# Altium project PCB_Project4.PrjPCB
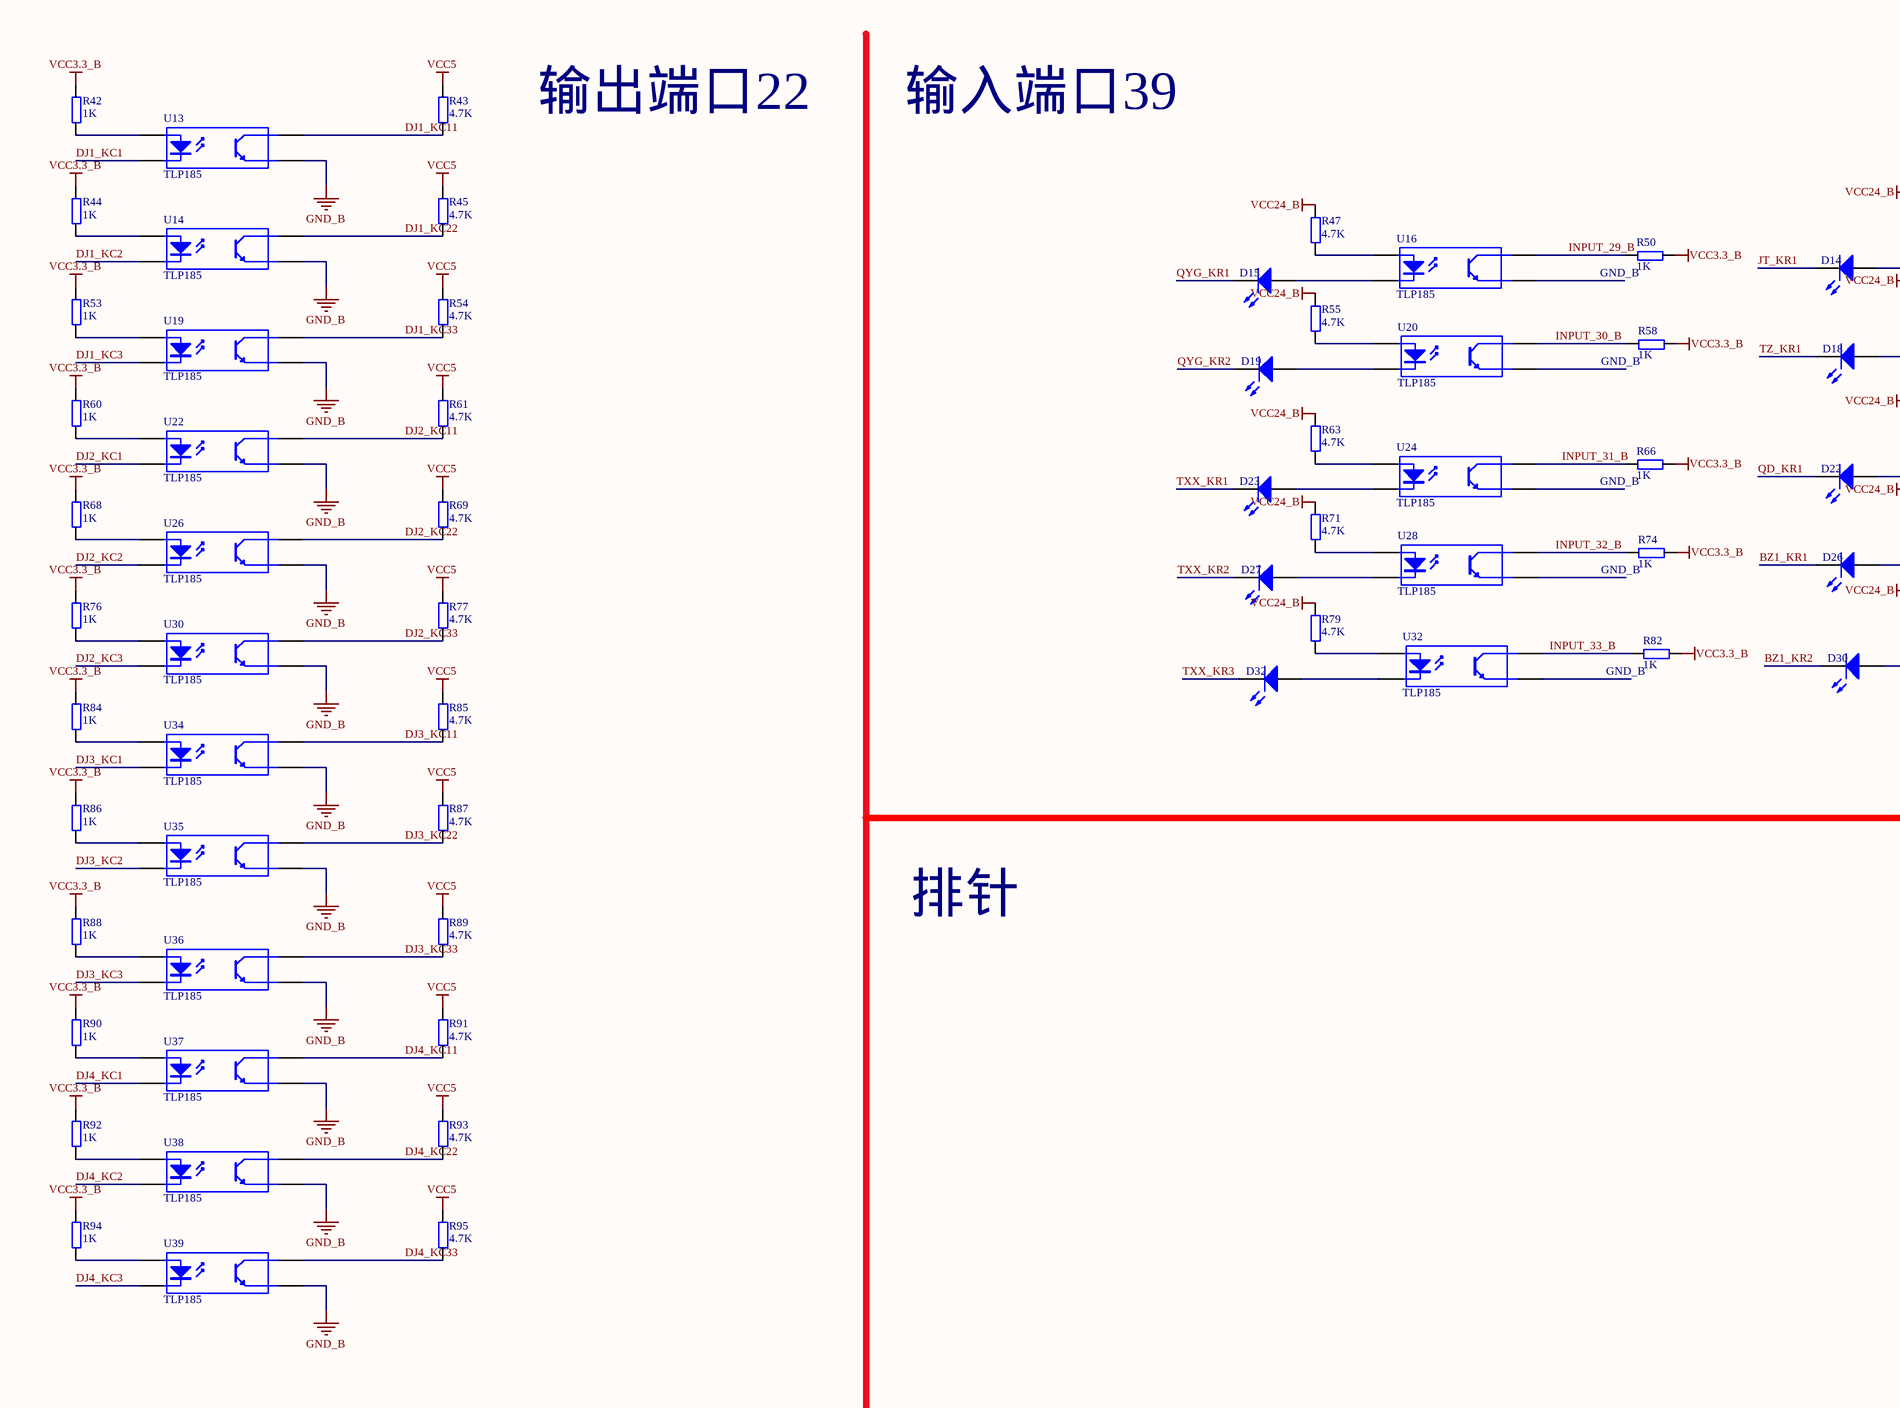
[diagram p0: 底板20160428.SchDoc, top left]
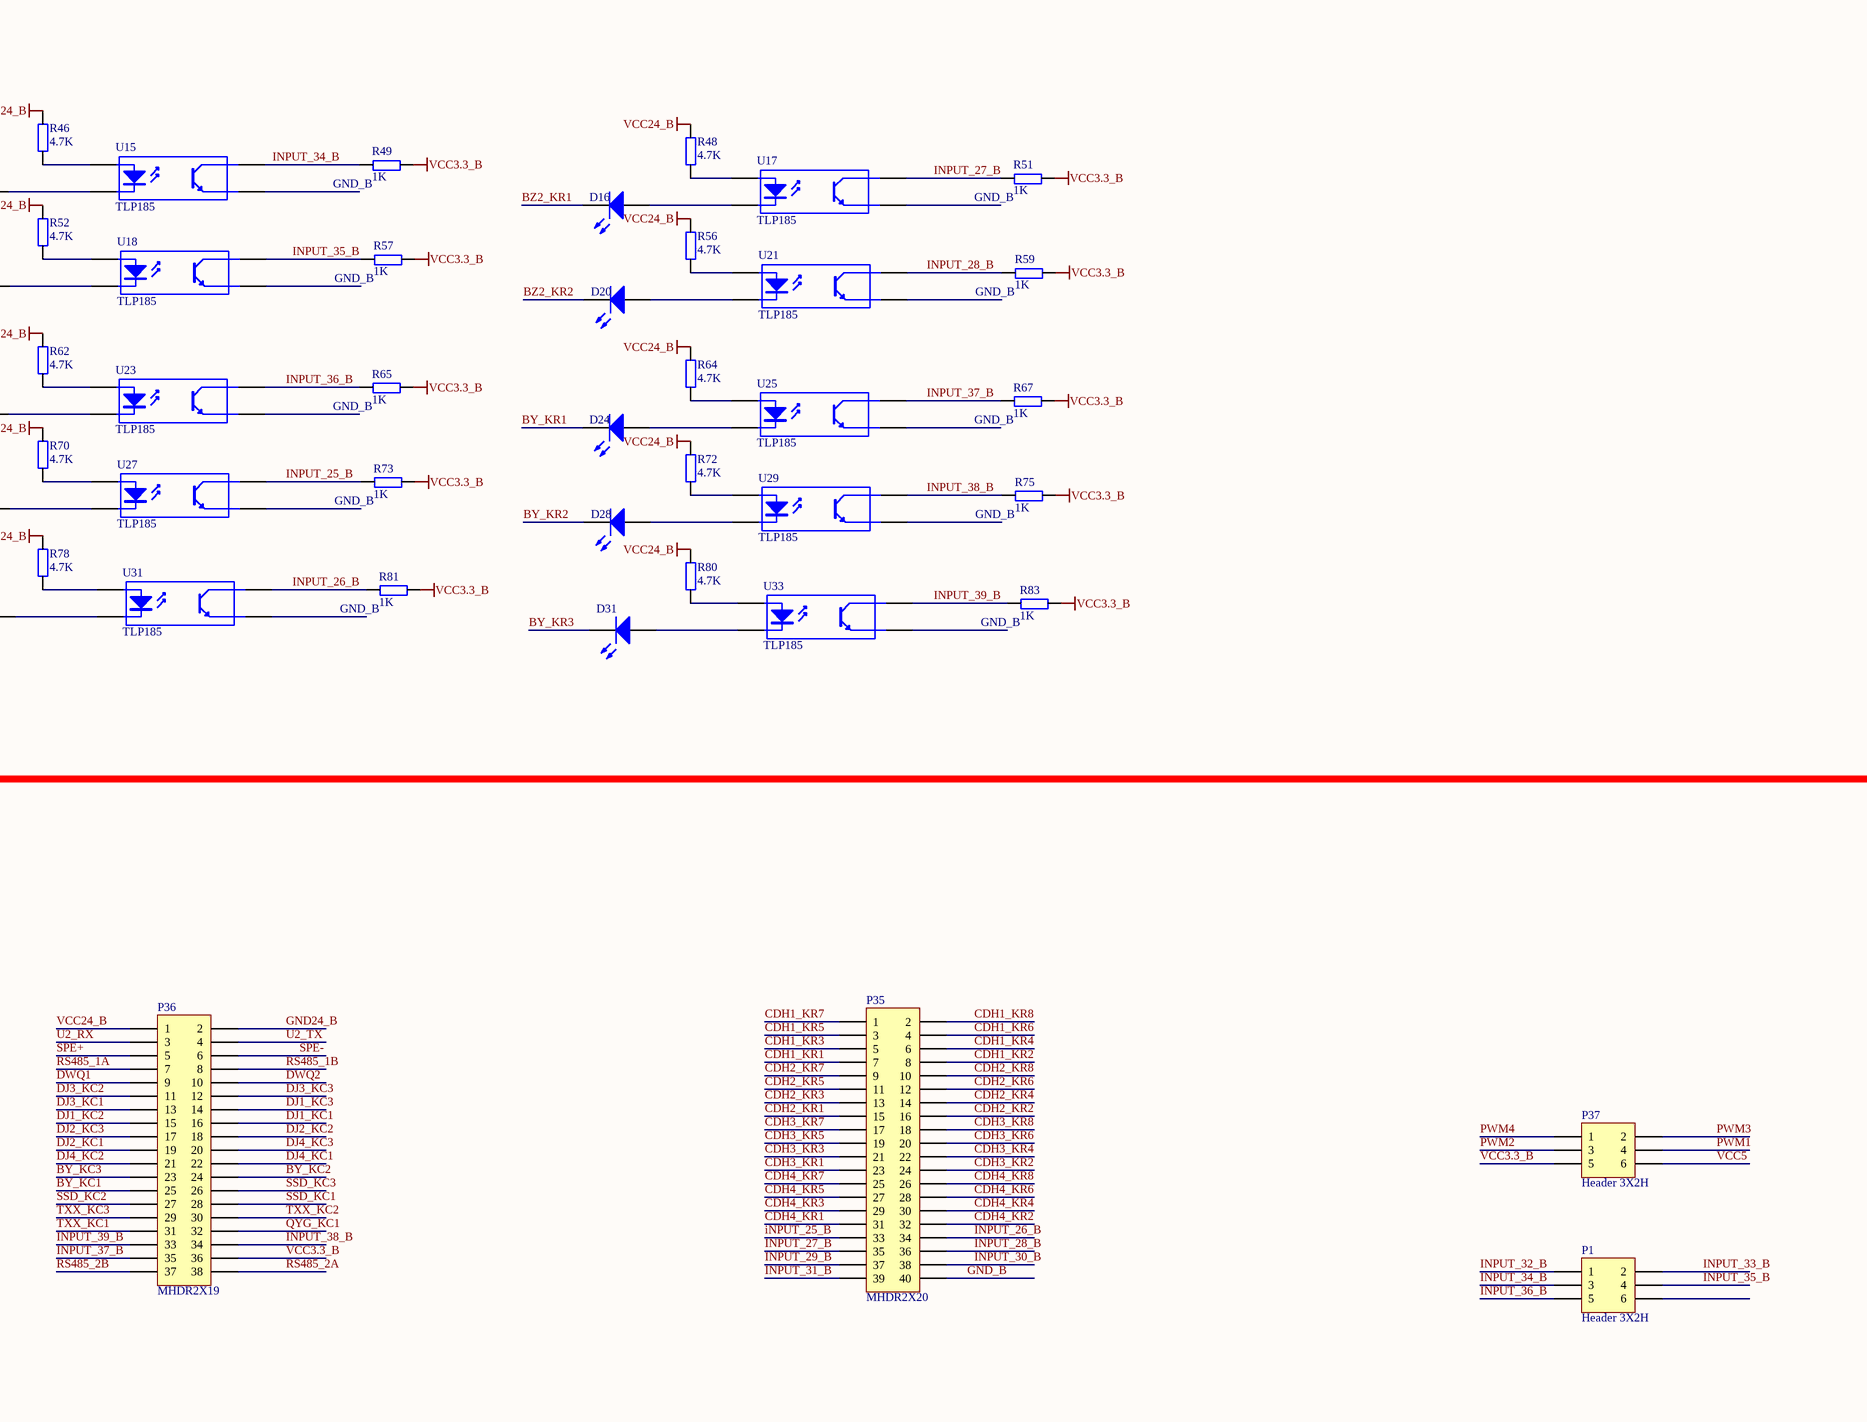
[diagram p1: 底板20160428.SchDoc, top right]
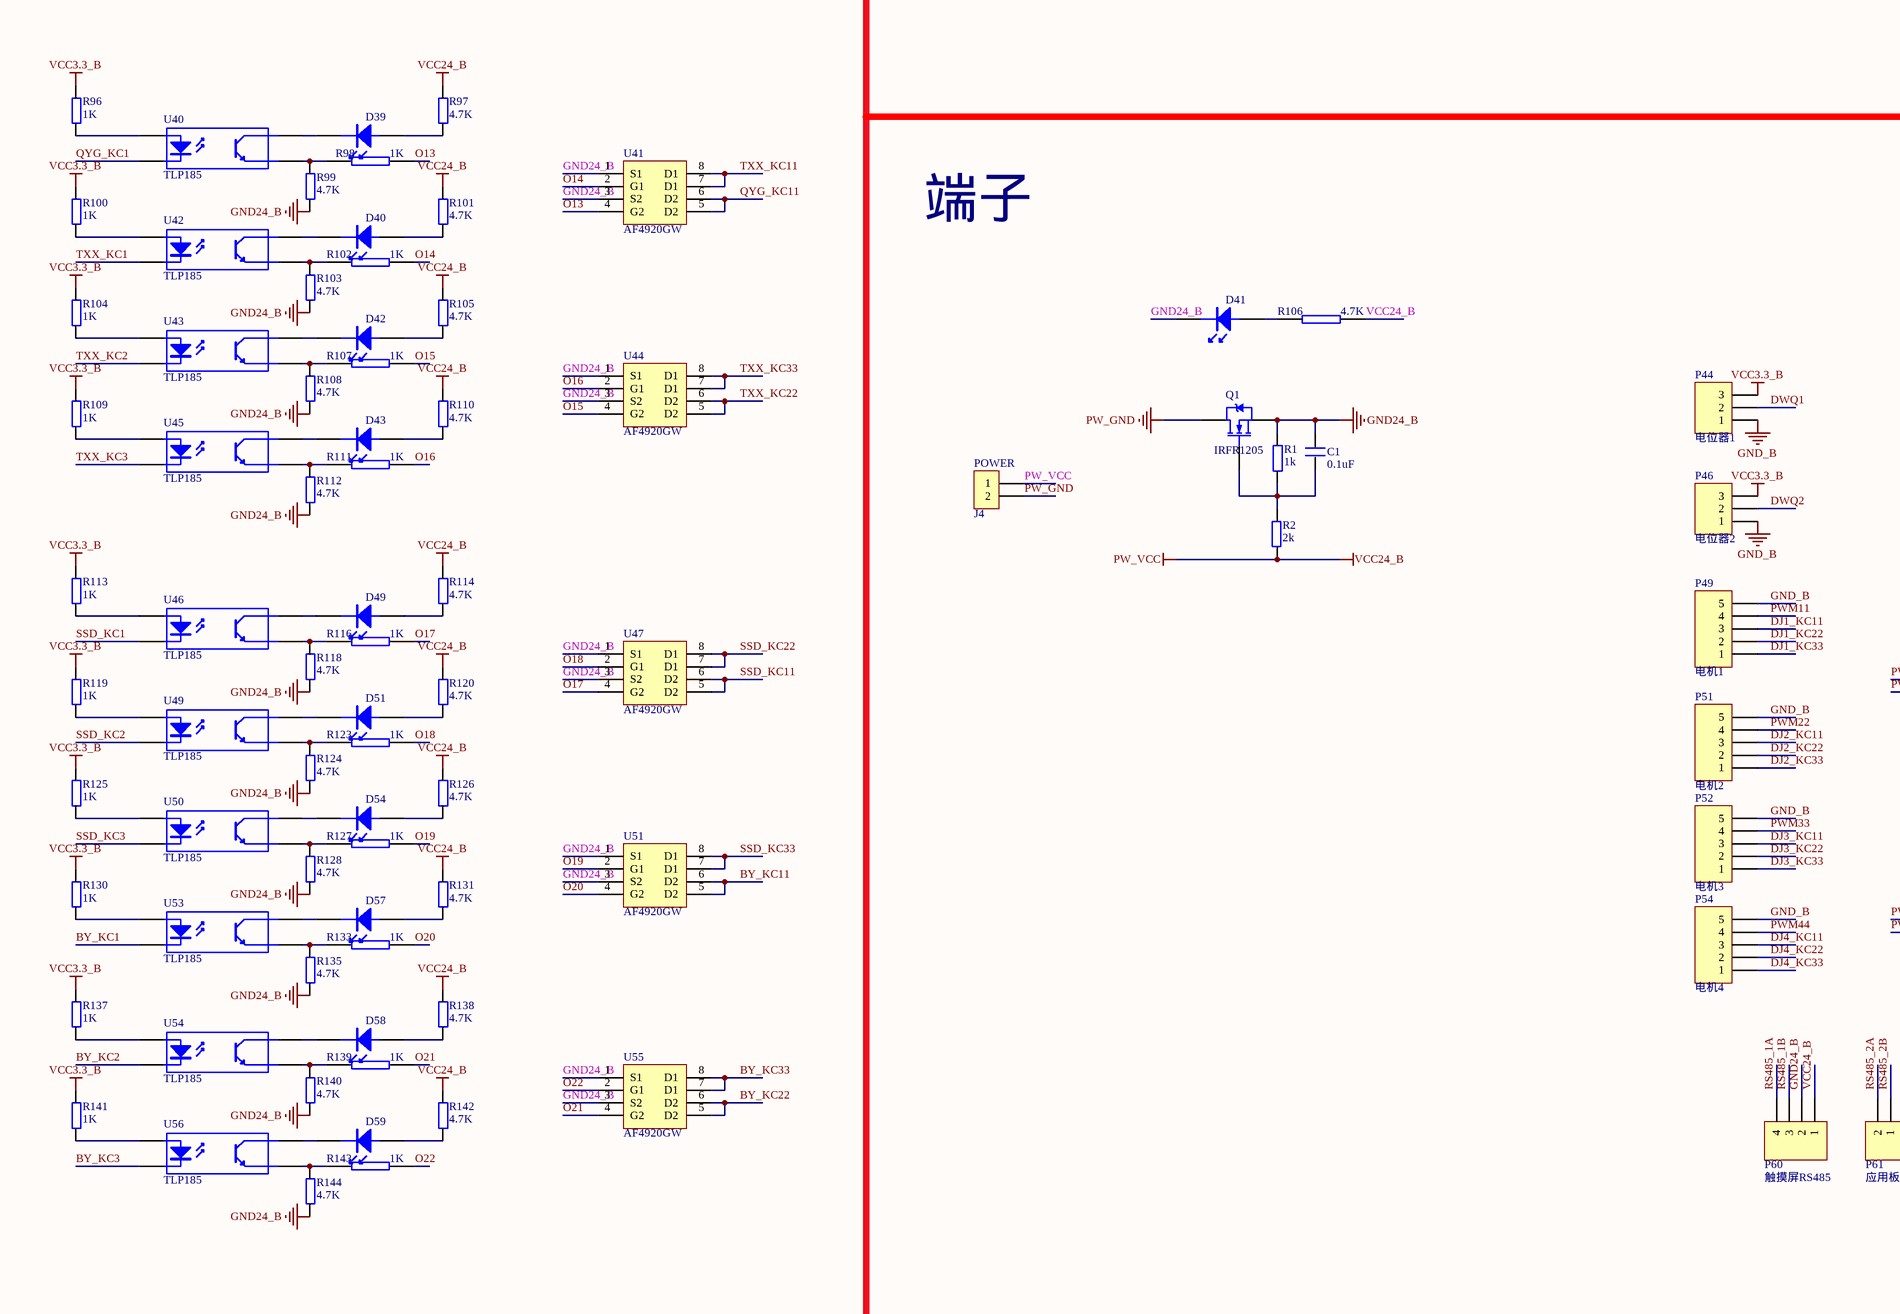
[diagram p2: 底板20160428.SchDoc, bottom left]
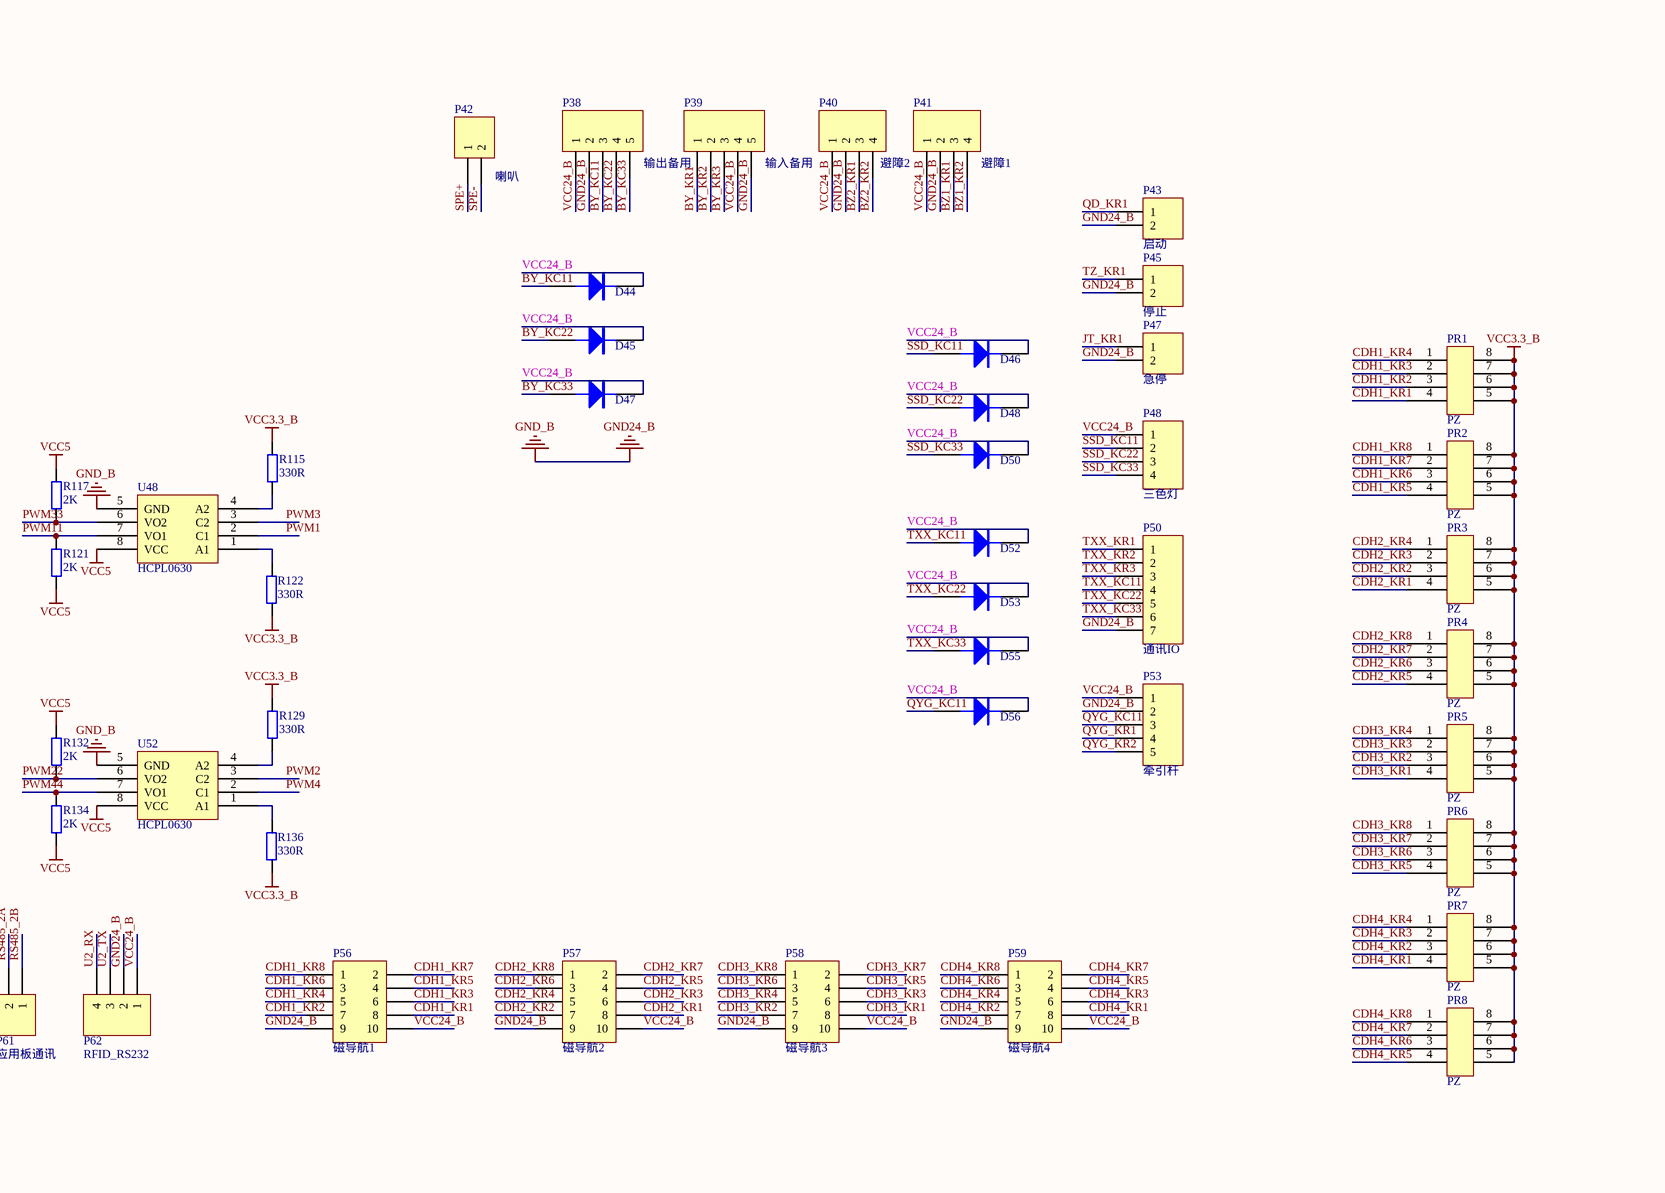
[diagram p3: 底板20160428.SchDoc, bottom right]
2 sheets, 237 parts. Net scope: global (net labels, ports and power ports of the same name join across sheets).
Board file: 底板20160428.PcbDoc
Sheets:
  底板20160428.SchDoc
  底板端子对应图.SchDoc

## Sheet 底板20160428.SchDoc
size A1

### Parts
(Parts that share a designator on the sheet are numbered #1, #2 ... from top to bottom, then left to right.)
C1  0.1uF  [0805]
D14  (no value)  [LED]
D15  (no value)  [LED]
D16  (no value)  [LED]
D18  (no value)  [LED]
D19  (no value)  [LED]
D20  (no value)  [LED]
D22  (no value)  [LED]
D23  (no value)  [LED]
D24  (no value)  [LED]
D26  (no value)  [LED]
D27  (no value)  [LED]
D28  (no value)  [LED]
D30  (no value)  [LED]
D31  (no value)  [LED]
D32  (no value)  [LED]
D39  (no value)  [LED]
D40  (no value)  [LED]
D41  (no value)  [LED]
D42  (no value)  [LED]
D43  (no value)  [LED]
D44  (no value)  [DIDOE]
D45  (no value)  [DIDOE]
D46  (no value)  [DIDOE]
D47  (no value)  [DIDOE]
D48  (no value)  [DIDOE]
D49  (no value)  [LED]
D50  (no value)  [DIDOE]
D51  (no value)  [LED]
D52  (no value)  [DIDOE]
D53  (no value)  [DIDOE]
D54  (no value)  [LED]
D55  (no value)  [DIDOE]
D56  (no value)  [DIDOE]
D57  (no value)  [LED]
D58  (no value)  [LED]
D59  (no value)  [LED]
J4  CON2  [DZ-2-3.5]  (value not drawn)
P1  Header 3X2H  [HDR2X3]
P35  MHDR2X20  [DIP-2X20]
P36  MHDR2X19  [DIP-2X19]
P37  Header 3X2H  [HDR2X3]
P38  输出备用  [DZ-5-3.5]
P39  输入备用  [DZ-5-3.5]
P40  避障2  [DZ-4-3.5]
P41  避障1  [DZ-4-3.5]
P42  喇叭  [DZ-2-3.5]
P43  启动  [DZ-2-3.5]
P44  电位器1  [DZ-3-3.5]
P45  停止  [DZ-2-3.5]
P46  电位器2  [DZ-3-3.5]
P47  急停  [DZ-2-3.5]
P48  三色灯  [DZ-4-3.5]
P49  电机1  [DZ-5-3.5]
P50  通讯IO  [DZ-7-3.5]
P51  电机2  [DZ-5-3.5]
P52  电机3  [DZ-5-3.5]
P53  牵引杆  [DZ-5-3.5]
P54  电机4  [DZ-5-3.5]
P56#1  磁导航1  [HDR2X5]
P57#1  磁导航2  [HDR2X5]
P58#1  磁导航3  [HDR2X5]
P59#1  磁导航4  [HDR2X5]
P60  触摸屏RS485  [DZ-4-3.5]
P61  应用板通讯  [DZ-2-3.5]
P62  RFID_RS232  [DZ-4-3.5]
PR1  PZ  [SOP8]
PR2  PZ  [SOP8]
PR3  PZ  [SOP8]
PR4  PZ  [SOP8]
PR5  PZ  [SOP8]
PR6  PZ  [SOP8]
PR7  PZ  [SOP8]
PR8  PZ  [SOP8]
Q1  IRFR1205  [TO-252AA]
R1  1k  [0805]
R2  2k  [0805]
R42  1K  [0805]
R43  4.7K  [0805]
R44  1K  [0805]
R45  4.7K  [0805]
R46  4.7K  [0805]
R47  4.7K  [0805]
R48  4.7K  [0805]
R49  1K  [0805]
R50  1K  [0805]
R51  1K  [0805]
R52  4.7K  [0805]
R53  1K  [0805]
R54  4.7K  [0805]
R55  4.7K  [0805]
R56  4.7K  [0805]
R57  1K  [0805]
R58  1K  [0805]
R59  1K  [0805]
R60  1K  [0805]
R61  4.7K  [0805]
R62  4.7K  [0805]
R63  4.7K  [0805]
R64  4.7K  [0805]
R65  1K  [0805]
R66  1K  [0805]
R67  1K  [0805]
R68  1K  [0805]
R69  4.7K  [0805]
R70  4.7K  [0805]
R71  4.7K  [0805]
R72  4.7K  [0805]
R73  1K  [0805]
R74  1K  [0805]
R75  1K  [0805]
R76  1K  [0805]
R77  4.7K  [0805]
R78  4.7K  [0805]
R79  4.7K  [0805]
R80  4.7K  [0805]
R81  1K  [0805]
R82  1K  [0805]
R83  1K  [0805]
R84  1K  [0805]
R85  4.7K  [0805]
R86  1K  [0805]
R87  4.7K  [0805]
R88  1K  [0805]
R89  4.7K  [0805]
R90  1K  [0805]
R91  4.7K  [0805]
R92  1K  [0805]
R93  4.7K  [0805]
R94  1K  [0805]
R95  4.7K  [0805]
R96  1K  [0805]
R97  4.7K  [0805]
R98  1K  [0805]
R99  4.7K  [0805]
R100  1K  [0805]
R101  4.7K  [0805]
R102  1K  [0805]
R103  4.7K  [0805]
R104  1K  [0805]
R105  4.7K  [0805]
R106  4.7K  [0805]
R107  1K  [0805]
R108  4.7K  [0805]
R109  1K  [0805]
R110  4.7K  [0805]
R111  1K  [0805]
R112  4.7K  [0805]
R113  1K  [0805]
R114  4.7K  [0805]
R115  330R  [0805]
R116  1K  [0805]
R117  2K  [0805]
R118  4.7K  [0805]
R119  1K  [0805]
R120  4.7K  [0805]
R121  2K  [0805]
R122  330R  [0805]
R123  1K  [0805]
R124  4.7K  [0805]
R125  1K  [0805]
R126  4.7K  [0805]
R127  1K  [0805]
R128  4.7K  [0805]
R129  330R  [0805]
R130  1K  [0805]
R131  4.7K  [0805]
R132  2K  [0805]
R133  1K  [0805]
R134  2K  [0805]
R135  4.7K  [0805]
R136  330R  [0805]
R137  1K  [0805]
R138  4.7K  [0805]
R139  1K  [0805]
R140  4.7K  [0805]
R141  1K  [0805]
R142  4.7K  [0805]
R143  1K  [0805]
R144  4.7K  [0805]
U13  TLP185  [TLP127]
U14  TLP185  [TLP127]
U15  TLP185  [TLP127]
U16  TLP185  [TLP127]
U17  TLP185  [TLP127]
U18  TLP185  [TLP127]
U19  TLP185  [TLP127]
U20  TLP185  [TLP127]
U21  TLP185  [TLP127]
U22  TLP185  [TLP127]
U23  TLP185  [TLP127]
U24  TLP185  [TLP127]
U25  TLP185  [TLP127]
U26  TLP185  [TLP127]
U27  TLP185  [TLP127]
U28  TLP185  [TLP127]
U29  TLP185  [TLP127]
U30  TLP185  [TLP127]
U31  TLP185  [TLP127]
U32  TLP185  [TLP127]
U33  TLP185  [TLP127]
U34  TLP185  [TLP127]
U35  TLP185  [TLP127]
U36  TLP185  [TLP127]
U37  TLP185  [TLP127]
U38  TLP185  [TLP127]
U39  TLP185  [TLP127]
U40  TLP185  [TLP127]
U41  AF4920GW  [SO-8]
U42  TLP185  [TLP127]
U43  TLP185  [TLP127]
U44  AF4920GW  [SO-8]
U45  TLP185  [TLP127]
U46  TLP185  [TLP127]
U47  AF4920GW  [SO-8]
U48  HCPL0630  [SO-8]
U49  TLP185  [TLP127]
U50  TLP185  [TLP127]
U51  AF4920GW  [SO-8]
U52  HCPL0630  [SO-8]
U53  TLP185  [TLP127]
U54  TLP185  [TLP127]
U55  AF4920GW  [SO-8]
U56  TLP185  [TLP127]

### Nets
GND24_B: C1.1 D41.2 P35.40 P36.2 P38.2 P39.5 P40.2 P41.2 P43.2 P44.1 P45.2 P46.1 P47.2 P49.5 P50.7 P51.5 P52.5 P53.2 P54.5 P56#1.9 P57#1.9 P58#1.9 P59#1.9 P60.2 P62.2 Q1.3(S) R1.2 R99.1 R103.1 R108.1 R112.1 R118.1 R124.1 R128.1 R135.1 R140.1 R144.1 U13.4(EMITTER) U14.4(EMITTER) U15.4(EMITTER) U16.4(EMITTER) U17.4(EMITTER) U18.4(EMITTER) U19.4(EMITTER) U20.4(EMITTER) U21.4(EMITTER) U22.4(EMITTER) U23.4(EMITTER) U24.4(EMITTER) U25.4(EMITTER) U26.4(EMITTER) U27.4(EMITTER) U28.4(EMITTER) U29.4(EMITTER) U30.4(EMITTER) U31.4(EMITTER) U32.4(EMITTER) U33.4(EMITTER) U34.4(EMITTER) U35.4(EMITTER) U36.4(EMITTER) U37.4(EMITTER) U38.4(EMITTER) U39.4(EMITTER) U41.1(S1) U41.3(S2) U44.1(S1) U44.3(S2) U47.1(S1) U47.3(S2) U48.5(GND) U51.1(S1) U51.3(S2) U52.5(GND) U55.1(S1) U55.3(S2)  [also labelled GND_B]
PW_GND: J4.2 Q1.2(D)
PW_VCC: D44.2(K) D45.2(K) D46.2(K) D47.2(K) D48.2(K) D50.2(K) D52.2(K) D53.2(K) D55.2(K) D56.2(K) J4.1 P36.1 P38.1 P39.4 P40.1 P41.1 P48.1 P53.1 P56#1.10 P57#1.10 P58#1.10 P59#1.10 P60.1 P62.1 R2.2 R46.2 R47.2 R48.2 R52.2 R55.2 R56.2 R62.2 R63.2 R64.2 R70.2 R71.2 R72.2 R78.2 R79.2 R80.2 R97.2 R101.2 R105.2 R106.1 R110.2 R114.2 R120.2 R126.2 R131.2 R138.2 R142.2  [also labelled VCC24_B]
VCC3.3_B: P36.36 P37.5 P44.3 P46.3 PR1.5 PR1.6 PR1.7 PR1.8 PR2.5 PR2.6 PR2.7 PR2.8 PR3.5 PR3.6 PR3.7 PR3.8 PR4.5 PR4.6 PR4.7 PR4.8 PR5.5 PR5.6 PR5.7 PR5.8 PR6.5 PR6.6 PR6.7 PR6.8 PR7.5 PR7.6 PR7.7 PR7.8 PR8.5 PR8.6 PR8.7 PR8.8 R42.2 R44.2 R49.2 R50.2 R51.2 R53.2 R57.2 R58.2 R59.2 R60.2 R65.2 R66.2 R67.2 R68.2 R73.2 R74.2 R75.2 R76.2 R81.2 R82.2 R83.2 R84.2 R86.2 R88.2 R90.2 R92.2 R94.2 R96.2 R100.2 R104.2 R109.2 R113.2 R115.2 R119.2 R122.2 R125.2 R129.2 R130.2 R136.2 R137.2 R141.2
VCC5: P37.6 R43.2 R45.2 R54.2 R61.2 R69.2 R77.2 R85.2 R87.2 R89.2 R91.2 R93.2 R95.2 R117.2 R121.1 R132.2 R134.1 U48.8(VCC) U52.8(VCC)
BY_KC1: P36.25 U53.3(CATHODE)
BY_KC2: P36.24 U54.3(CATHODE)
BY_KC3: P36.23 U56.3(CATHODE)
BY_KC11: D44.1(A) P38.3 U51.5(D2) U51.6(D2)
BY_KC22: D45.1(A) P38.4 U55.5(D2) U55.6(D2)
BY_KC33: D47.1(A) P38.5 U55.7(D1) U55.8(D1)
BY_KR1: D24.2(K) P39.1
BY_KR2: D28.2(K) P39.2
BY_KR3: D31.2(K) P39.3
BZ1_KR1: D26.2(K) P41.3
BZ1_KR2: D30.2(K) P41.4
BZ2_KR1: D16.2(K) P40.3
BZ2_KR2: D20.2(K) P40.4
CDH1_KR1: P35.7 P56#1.8 PR1.4
CDH1_KR2: P35.8 P56#1.7 PR1.3
CDH1_KR3: P35.5 P56#1.6 PR1.2
CDH1_KR4: P35.6 P56#1.5 PR1.1
CDH1_KR5: P35.3 P56#1.4 PR2.4
CDH1_KR6: P35.4 P56#1.3 PR2.3
CDH1_KR7: P35.1 P56#1.2 PR2.2
CDH1_KR8: P35.2 P56#1.1 PR2.1
CDH2_KR1: P35.15 P57#1.8 PR3.4
CDH2_KR2: P35.16 P57#1.7 PR3.3
CDH2_KR3: P35.13 P57#1.6 PR3.2
CDH2_KR4: P35.14 P57#1.5 PR3.1
CDH2_KR5: P35.11 P57#1.4 PR4.4
CDH2_KR6: P35.12 P57#1.3 PR4.3
CDH2_KR7: P35.9 P57#1.2 PR4.2
CDH2_KR8: P35.10 P57#1.1 PR4.1
CDH3_KR1: P35.23 P58#1.8 PR5.4
CDH3_KR2: P35.24 P58#1.7 PR5.3
CDH3_KR3: P35.21 P58#1.6 PR5.2
CDH3_KR4: P35.22 P58#1.5 PR5.1
CDH3_KR5: P35.19 P58#1.4 PR6.4
CDH3_KR6: P35.20 P58#1.3 PR6.3
CDH3_KR7: P35.17 P58#1.2 PR6.2
CDH3_KR8: P35.18 P58#1.1 PR6.1
CDH4_KR1: P35.31 P59#1.8 PR7.4
CDH4_KR2: P35.32 P59#1.7 PR7.3
CDH4_KR3: P35.29 P59#1.6 PR7.2
CDH4_KR4: P35.30 P59#1.5 PR7.1
CDH4_KR5: P35.27 P59#1.4 PR8.4
CDH4_KR6: P35.28 P59#1.3 PR8.3
CDH4_KR7: P35.25 P59#1.2 PR8.2
CDH4_KR8: P35.26 P59#1.1 PR8.1
DJ1_KC1: P36.16 U13.3(CATHODE)
DJ1_KC2: P36.15 U14.3(CATHODE)
DJ1_KC3: P36.14 U19.3(CATHODE)
DJ1_KC11: P49.3 R43.1 U13.6(COLLECTOR)
DJ1_KC22: P49.2 R45.1 U14.6(COLLECTOR)
DJ1_KC33: P49.1 R54.1 U19.6(COLLECTOR)
DJ2_KC1: P36.19 U22.3(CATHODE)
DJ2_KC2: P36.18 U26.3(CATHODE)
DJ2_KC3: P36.17 U30.3(CATHODE)
DJ2_KC11: P51.3 R61.1 U22.6(COLLECTOR)
DJ2_KC22: P51.2 R69.1 U26.6(COLLECTOR)
DJ2_KC33: P51.1 R77.1 U30.6(COLLECTOR)
DJ3_KC1: P36.13 U34.3(CATHODE)
DJ3_KC2: P36.11 U35.3(CATHODE)
DJ3_KC3: P36.12 U36.3(CATHODE)
DJ3_KC11: P52.3 R85.1 U34.6(COLLECTOR)
DJ3_KC22: P52.2 R87.1 U35.6(COLLECTOR)
DJ3_KC33: P52.1 R89.1 U36.6(COLLECTOR)
DJ4_KC1: P36.22 U37.3(CATHODE)
DJ4_KC2: P36.21 U38.3(CATHODE)
DJ4_KC3: P36.20 U39.3(CATHODE)
DJ4_KC11: P54.3 R91.1 U37.6(COLLECTOR)
DJ4_KC22: P54.2 R93.1 U38.6(COLLECTOR)
DJ4_KC33: P54.1 R95.1 U39.6(COLLECTOR)
DWQ1: P36.9 P44.2
DWQ2: P36.10 P46.2
INPUT_25_B: P35.33 R73.1 U27.6(COLLECTOR)
INPUT_26_B: P35.34 R81.1 U31.6(COLLECTOR)
INPUT_27_B: P35.35 R51.1 U17.6(COLLECTOR)
INPUT_28_B: P35.36 R59.1 U21.6(COLLECTOR)
INPUT_29_B: P35.37 R50.1 U16.6(COLLECTOR)
INPUT_30_B: P35.38 R58.1 U20.6(COLLECTOR)
INPUT_31_B: P35.39 R66.1 U24.6(COLLECTOR)
INPUT_32_B: P1.1 R74.1 U28.6(COLLECTOR)
INPUT_33_B: P1.2 R82.1 U32.6(COLLECTOR)
INPUT_34_B: P1.3 R49.1 U15.6(COLLECTOR)
INPUT_35_B: P1.4 R57.1 U18.6(COLLECTOR)
INPUT_36_B: P1.5 R65.1 U23.6(COLLECTOR)
INPUT_37_B: P36.35 R67.1 U25.6(COLLECTOR)
INPUT_38_B: P36.34 R75.1 U29.6(COLLECTOR)
INPUT_39_B: P36.33 R83.1 U33.6(COLLECTOR)
JT_KR1: D14.2(K) P47.1
O13: R98.1 U41.4(G2)
O14: R102.1 U41.2(G1)
O15: R107.1 U44.4(G2)
O16: R111.1 U44.2(G1)
O17: R116.1 U47.4(G2)
O18: R123.1 U47.2(G1)
O19: R127.1 U51.2(G1)
O20: R133.1 U51.4(G2)
O21: R139.1 U55.4(G2)
O22: R143.1 U55.2(G1)
PWM1: P37.4 U48.2(C1)
PWM2: P37.3 U52.3(C2)
PWM3: P37.2 U48.3(C2)
PWM4: P37.1 U52.2(C1)
PWM11: P49.4 R121.2 U48.7(VO1)
PWM22: P51.4 R132.1 U52.6(VO2)
PWM33: P52.4 R117.1 U48.6(VO2)
PWM44: P54.4 R134.2 U52.7(VO1)
QD_KR1: D22.2(K) P43.1
QYG_KC1: P36.32 U40.3(CATHODE)
QYG_KC11: D56.1(A) P53.3 U41.5(D2) U41.6(D2)
QYG_KR1: D15.2(K) P53.4
QYG_KR2: D19.2(K) P53.5
RS485_1A: P36.7 P60.4
RS485_1B: P36.8 P60.3
RS485_2A: P36.38 P61.2
RS485_2B: P36.37 P61.1
SPE+: P36.5 P42.1
SPE-: P36.6 P42.2
SSD_KC1: P36.28 U46.3(CATHODE)
SSD_KC2: P36.27 U49.3(CATHODE)
SSD_KC3: P36.26 U50.3(CATHODE)
SSD_KC11: D46.1(A) P48.2 U47.5(D2) U47.6(D2)
SSD_KC22: D48.1(A) P48.3 U47.7(D1) U47.8(D1)
SSD_KC33: D50.1(A) P48.4 U51.7(D1) U51.8(D1)
TXX_KC1: P36.31 U42.3(CATHODE)
TXX_KC2: P36.30 U43.3(CATHODE)
TXX_KC3: P36.29 U45.3(CATHODE)
TXX_KC11: D52.1(A) P50.4 U41.7(D1) U41.8(D1)
TXX_KC22: D53.1(A) P50.5 U44.5(D2) U44.6(D2)
TXX_KC33: D55.1(A) P50.6 U44.7(D1) U44.8(D1)
TXX_KR1: D23.2(K) P50.1
TXX_KR2: D27.2(K) P50.2
TXX_KR3: D32.2(K) P50.3
TZ_KR1: D18.2(K) P45.1
U2_RX: P36.3 P62.4
U2_TX: P36.4 P62.3
NetC1_2: C1.2 Q1.1(G) R1.1 R2.1
NetD14_1: D14.1(A) U15.3(CATHODE)
NetD15_1: D15.1(A) U16.3(CATHODE)
NetD16_1: D16.1(A) U17.3(CATHODE)
NetD18_1: D18.1(A) U18.3(CATHODE)
NetD19_1: D19.1(A) U20.3(CATHODE)
NetD20_1: D20.1(A) U21.3(CATHODE)
NetD22_1: D22.1(A) U23.3(CATHODE)
NetD23_1: D23.1(A) U24.3(CATHODE)
NetD24_1: D24.1(A) U25.3(CATHODE)
NetD26_1: D26.1(A) U27.3(CATHODE)
NetD27_1: D27.1(A) U28.3(CATHODE)
NetD28_1: D28.1(A) U29.3(CATHODE)
NetD30_1: D30.1(A) U31.3(CATHODE)
NetD31_1: D31.1(A) U33.3(CATHODE)
NetD32_1: D32.1(A) U32.3(CATHODE)
NetD39_1: D39.1 R97.1
NetD39_2: D39.2 U40.6(COLLECTOR)
NetD40_1: D40.1 R101.1
NetD40_2: D40.2 U42.6(COLLECTOR)
NetD41_1: D41.1 R106.2
NetD42_1: D42.1 R105.1
NetD42_2: D42.2 U43.6(COLLECTOR)
NetD43_1: D43.1 R110.1
NetD43_2: D43.2 U45.6(COLLECTOR)
NetD49_1: D49.1 R114.1
NetD49_2: D49.2 U46.6(COLLECTOR)
NetD51_1: D51.1 R120.1
NetD51_2: D51.2 U49.6(COLLECTOR)
NetD54_1: D54.1 R126.1
NetD54_2: D54.2 U50.6(COLLECTOR)
NetD57_1: D57.1 R131.1
NetD57_2: D57.2 U53.6(COLLECTOR)
NetD58_1: D58.1 R138.1
NetD58_2: D58.2 U54.6(COLLECTOR)
NetD59_1: D59.1 R142.1
NetD59_2: D59.2 U56.6(COLLECTOR)
NetR42_1: R42.1 U13.1(ANODE)
NetR44_1: R44.1 U14.1(ANODE)
NetR46_1: R46.1 U15.1(ANODE)
NetR47_1: R47.1 U16.1(ANODE)
NetR48_1: R48.1 U17.1(ANODE)
NetR52_1: R52.1 U18.1(ANODE)
NetR53_1: R53.1 U19.1(ANODE)
NetR55_1: R55.1 U20.1(ANODE)
NetR56_1: R56.1 U21.1(ANODE)
NetR60_1: R60.1 U22.1(ANODE)
NetR62_1: R62.1 U23.1(ANODE)
NetR63_1: R63.1 U24.1(ANODE)
NetR64_1: R64.1 U25.1(ANODE)
NetR68_1: R68.1 U26.1(ANODE)
NetR70_1: R70.1 U27.1(ANODE)
NetR71_1: R71.1 U28.1(ANODE)
NetR72_1: R72.1 U29.1(ANODE)
NetR76_1: R76.1 U30.1(ANODE)
NetR78_1: R78.1 U31.1(ANODE)
NetR79_1: R79.1 U32.1(ANODE)
NetR80_1: R80.1 U33.1(ANODE)
NetR84_1: R84.1 U34.1(ANODE)
NetR86_1: R86.1 U35.1(ANODE)
NetR88_1: R88.1 U36.1(ANODE)
NetR90_1: R90.1 U37.1(ANODE)
NetR92_1: R92.1 U38.1(ANODE)
NetR94_1: R94.1 U39.1(ANODE)
NetR96_1: R96.1 U40.1(ANODE)
NetR98_2: R98.2 R99.2 U40.4(EMITTER)
NetR100_1: R100.1 U42.1(ANODE)
NetR102_2: R102.2 R103.2 U42.4(EMITTER)
NetR104_1: R104.1 U43.1(ANODE)
NetR107_2: R107.2 R108.2 U43.4(EMITTER)
NetR109_1: R109.1 U45.1(ANODE)
NetR111_2: R111.2 R112.2 U45.4(EMITTER)
NetR113_1: R113.1 U46.1(ANODE)
NetR115_1: R115.1 U48.4(A2)
NetR116_2: R116.2 R118.2 U46.4(EMITTER)
NetR119_1: R119.1 U49.1(ANODE)
NetR122_1: R122.1 U48.1(A1)
NetR123_2: R123.2 R124.2 U49.4(EMITTER)
NetR125_1: R125.1 U50.1(ANODE)
NetR127_2: R127.2 R128.2 U50.4(EMITTER)
NetR129_1: R129.1 U52.4(A2)
NetR130_1: R130.1 U53.1(ANODE)
NetR133_2: R133.2 R135.2 U53.4(EMITTER)
NetR136_1: R136.1 U52.1(A1)
NetR137_1: R137.1 U54.1(ANODE)
NetR139_2: R139.2 R140.2 U54.4(EMITTER)
NetR141_1: R141.1 U56.1(ANODE)
NetR143_2: R143.2 R144.2 U56.4(EMITTER)

Not connected (* = marked no-connect by the designer): P1 6

### Notes on the sheet
- 输出端口22
- 输入端口39
- 排针
- 端子
- (near J4) POWER

### Library data of the parts
C1 = C
D14-D16 D18-D20 D22-D24 D26-D28 D30-D32 = LED0: Typical INFRARED GaAs LED; Published: 8-Jun-2000; LatestRevisionDate: 08-Jul-2005; LatestRevisionNote: Mech Layer 1 removed.; PackageReference: LED-0; Publisher: Altium Limited; PackageDescription: LED; 2 Leads
D39-D43 D49 D51 D54 D57-D59 = LED
D44-D48 D50 D52 D53 D55 D56 = DIODE
J4 = CON2: Connector
P1 P37 = Header 3X2H: Header, 3-Pin, Dual row, Right Angle; LatestRevisionDate: 17-Jul-2002; LatestRevisionNote: Re-released for DXP Platform.; Publisher: Altium Limited
P35 = MHDR2X20: Header, 20-Pin, Dual row; LatestRevisionDate: 17-Jul-2002; LatestRevisionNote: Re-released for DXP Platform.; Publisher: Altium Limited
P36 = MHDR2X19: Header, 19-Pin, Dual row; LatestRevisionDate: 17-Jul-2002; LatestRevisionNote: Re-released for DXP Platform.; Publisher: Altium Limited
P38 P39 P49 P51-P54 = Header 5: Header, 5-Pin; LatestRevisionDate: 17-Jul-2002; LatestRevisionNote: Re-released for DXP Platform.; Publisher: Altium Limited
P40 P41 P48 P60 P62 = Header 4: Header, 4-Pin; LatestRevisionDate: 17-Jul-2002; LatestRevisionNote: Re-released for DXP Platform.; Publisher: Altium Limited
P42 P43 P45 P47 P61 = Header 2: Header, 2-Pin; LatestRevisionDate: 17-Jul-2002; LatestRevisionNote: Re-released for DXP Platform.; Publisher: Altium Limited
P44 P46 = Header 3: Header, 3-Pin; LatestRevisionDate: 17-Jul-2002; LatestRevisionNote: Re-released for DXP Platform.; Publisher: Altium Limited
P50 = Header 7: Header, 7-Pin; LatestRevisionDate: 17-Jul-2002; LatestRevisionNote: Re-released for DXP Platform.; Publisher: Altium Limited
P56#1 P57#1 P58#1 P59#1 = Header 5X2H: Header, 5-Pin, Dual row, Right Angle; LatestRevisionDate: 17-Jul-2002; LatestRevisionNote: Re-released for DXP Platform.; Publisher: Altium Limited
Q1 = NMOS-2: N-Channel Power MOSFET; Note: Pin 2 is electrically connected to pin 4.; Published: 8-Jun-2000; LatestRevisionDate: 17-Jul-2002; LatestRevisionNote: Re-released for DXP Platform.; DatasheetVersion: PD-9.814; PackageVersion: Feb-1997; PackageReference: TO-220AB; Publisher: Altium Limited; PackageDescription: TO, Thru-Hole, Vertical, Heatsink Mounted; 3 In-Line Leads; Pitch 2.54 mm; ComponentLink1Description: Manufacturer Link; ComponentLink1URL: http://www.irf.com/
R1 R2 R42-R97 R99-R101 R103-R105 R108-R110 R112-R115 R117-R122 R124-R126 R128-R132 R134-R138 R140-R142 R144 = R_2
R98 R102 R106 R107 R111 R116 R123 R127 R133 R139 R143 = RES2
U13-U40 U42 U43 U45 U46 U49 U50 U53 U54 U56 = TLP127
U41 U44 U47 U51 U55 = AF4920N

## Sheet 底板端子对应图.SchDoc
size A3
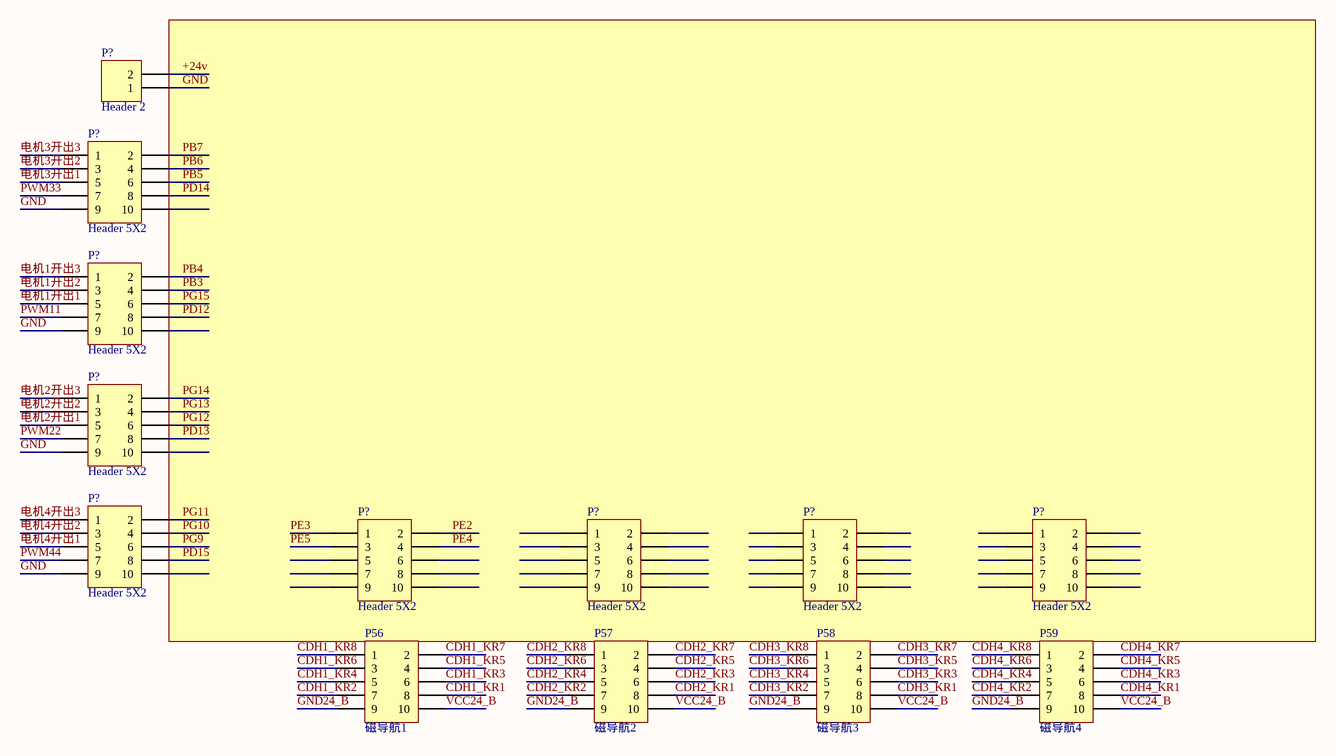
[diagram p4: 底板端子对应图.SchDoc]

### Parts
(Parts that share a designator on the sheet are numbered #1, #2 ... from top to bottom, then left to right.)
P56#2  磁导航1  [HDR2X5]
P57#2  磁导航2  [HDR2X5]
P58#2  磁导航3  [HDR2X5]
P59#2  磁导航4  [HDR2X5]
P?#1  Header 2  [HDR1X2]
P?#2  Header 5X2  [HDR2X5]
P?#3  Header 5X2  [HDR2X5]
P?#4  Header 5X2  [HDR2X5]
P?#5  Header 5X2  [HDR2X5]
P?#6  Header 5X2  [HDR2X5]
P?#7  Header 5X2  [HDR2X5]
P?#8  Header 5X2  [HDR2X5]
P?#9  Header 5X2  [HDR2X5]

### Nets
GND24_B: P56#2.9 P57#2.9 P58#2.9 P59#2.9
VCC24_B: P56#2.10 P57#2.10 P58#2.10 P59#2.10  [project net PW_VCC]
+24v: P?#1.2
CDH1_KR1: P56#2.8
CDH1_KR2: P56#2.7
CDH1_KR3: P56#2.6
CDH1_KR4: P56#2.5
CDH1_KR5: P56#2.4
CDH1_KR6: P56#2.3
CDH1_KR7: P56#2.2
CDH1_KR8: P56#2.1
CDH2_KR1: P57#2.8
CDH2_KR2: P57#2.7
CDH2_KR3: P57#2.6
CDH2_KR4: P57#2.5
CDH2_KR5: P57#2.4
CDH2_KR6: P57#2.3
CDH2_KR7: P57#2.2
CDH2_KR8: P57#2.1
CDH3_KR1: P58#2.8
CDH3_KR2: P58#2.7
CDH3_KR3: P58#2.6
CDH3_KR4: P58#2.5
CDH3_KR5: P58#2.4
CDH3_KR6: P58#2.3
CDH3_KR7: P58#2.2
CDH3_KR8: P58#2.1
CDH4_KR1: P59#2.8
CDH4_KR2: P59#2.7
CDH4_KR3: P59#2.6
CDH4_KR4: P59#2.5
CDH4_KR5: P59#2.4
CDH4_KR6: P59#2.3
CDH4_KR7: P59#2.2
CDH4_KR8: P59#2.1
GND: P?#1.1 P?#2.9 P?#3.9 P?#4.9 P?#5.9
PB3: P?#3.4
PB4: P?#3.2
PB5: P?#2.6
PB6: P?#2.4
PB7: P?#2.2
PD12: P?#3.8
PD13: P?#4.8
PD14: P?#2.8
PD15: P?#5.8
PE2: P?#6.2
PE3: P?#6.1
PE4: P?#6.4
PE5: P?#6.3
PG9: P?#5.6
PG10: P?#5.4
PG11: P?#5.2
PG12: P?#4.6
PG13: P?#4.4
PG14: P?#4.2
PG15: P?#3.6
PWM11: P?#3.7
PWM22: P?#4.7
PWM33: P?#2.7
PWM44: P?#5.7
电机1开出1: P?#3.5
电机1开出2: P?#3.3
电机1开出3: P?#3.1
电机2开出1: P?#4.5
电机2开出2: P?#4.3
电机2开出3: P?#4.1
电机3开出1: P?#2.5
电机3开出2: P?#2.3
电机3开出3: P?#2.1
电机4开出1: P?#5.5
电机4开出2: P?#5.3
电机4开出3: P?#5.1

Not connected (* = marked no-connect by the designer): P?#2 10; P?#3 10; P?#4 10; P?#5 10; P?#6 5 6 7 8 9 10; P?#7 1 2 3 4 5 6 7 8 9 10; P?#8 1 2 3 4 5 6 7 8 9 10; P?#9 1 2 3 4 5 6 7 8 9 10

### Library data of the parts
P56#2 P57#2 P58#2 P59#2 = Header 5X2H: Header, 5-Pin, Dual row, Right Angle; LatestRevisionDate: 17-Jul-2002; LatestRevisionNote: Re-released for DXP Platform.; Publisher: Altium Limited
P?#1 = Header 2: Header, 2-Pin; LatestRevisionDate: 17-Jul-2002; LatestRevisionNote: Re-released for DXP Platform.; Publisher: Altium Limited
P?#2-P?#9 = Header 5X2: Header, 5-Pin, Dual row; LatestRevisionDate: 17-Jul-2002; LatestRevisionNote: Re-released for DXP Platform.; Publisher: Altium Limited

## Nets that join several sheets
GND24_B: 底板20160428 (76 pins), 底板端子对应图 (P56#2.9 P57#2.9 P58#2.9 P59#2.9)
PW_VCC: 底板20160428 (51 pins), 底板端子对应图 (P56#2.10 P57#2.10 P58#2.10 P59#2.10)
CDH1_KR1: 底板20160428 (P35.7 P56#1.8 PR1.4), 底板端子对应图 (P56#2.8)
CDH1_KR2: 底板20160428 (P35.8 P56#1.7 PR1.3), 底板端子对应图 (P56#2.7)
CDH1_KR3: 底板20160428 (P35.5 P56#1.6 PR1.2), 底板端子对应图 (P56#2.6)
CDH1_KR4: 底板20160428 (P35.6 P56#1.5 PR1.1), 底板端子对应图 (P56#2.5)
CDH1_KR5: 底板20160428 (P35.3 P56#1.4 PR2.4), 底板端子对应图 (P56#2.4)
CDH1_KR6: 底板20160428 (P35.4 P56#1.3 PR2.3), 底板端子对应图 (P56#2.3)
CDH1_KR7: 底板20160428 (P35.1 P56#1.2 PR2.2), 底板端子对应图 (P56#2.2)
CDH1_KR8: 底板20160428 (P35.2 P56#1.1 PR2.1), 底板端子对应图 (P56#2.1)
CDH2_KR1: 底板20160428 (P35.15 P57#1.8 PR3.4), 底板端子对应图 (P57#2.8)
CDH2_KR2: 底板20160428 (P35.16 P57#1.7 PR3.3), 底板端子对应图 (P57#2.7)
CDH2_KR3: 底板20160428 (P35.13 P57#1.6 PR3.2), 底板端子对应图 (P57#2.6)
CDH2_KR4: 底板20160428 (P35.14 P57#1.5 PR3.1), 底板端子对应图 (P57#2.5)
CDH2_KR5: 底板20160428 (P35.11 P57#1.4 PR4.4), 底板端子对应图 (P57#2.4)
CDH2_KR6: 底板20160428 (P35.12 P57#1.3 PR4.3), 底板端子对应图 (P57#2.3)
CDH2_KR7: 底板20160428 (P35.9 P57#1.2 PR4.2), 底板端子对应图 (P57#2.2)
CDH2_KR8: 底板20160428 (P35.10 P57#1.1 PR4.1), 底板端子对应图 (P57#2.1)
CDH3_KR1: 底板20160428 (P35.23 P58#1.8 PR5.4), 底板端子对应图 (P58#2.8)
CDH3_KR2: 底板20160428 (P35.24 P58#1.7 PR5.3), 底板端子对应图 (P58#2.7)
CDH3_KR3: 底板20160428 (P35.21 P58#1.6 PR5.2), 底板端子对应图 (P58#2.6)
CDH3_KR4: 底板20160428 (P35.22 P58#1.5 PR5.1), 底板端子对应图 (P58#2.5)
CDH3_KR5: 底板20160428 (P35.19 P58#1.4 PR6.4), 底板端子对应图 (P58#2.4)
CDH3_KR6: 底板20160428 (P35.20 P58#1.3 PR6.3), 底板端子对应图 (P58#2.3)
CDH3_KR7: 底板20160428 (P35.17 P58#1.2 PR6.2), 底板端子对应图 (P58#2.2)
CDH3_KR8: 底板20160428 (P35.18 P58#1.1 PR6.1), 底板端子对应图 (P58#2.1)
CDH4_KR1: 底板20160428 (P35.31 P59#1.8 PR7.4), 底板端子对应图 (P59#2.8)
CDH4_KR2: 底板20160428 (P35.32 P59#1.7 PR7.3), 底板端子对应图 (P59#2.7)
CDH4_KR3: 底板20160428 (P35.29 P59#1.6 PR7.2), 底板端子对应图 (P59#2.6)
CDH4_KR4: 底板20160428 (P35.30 P59#1.5 PR7.1), 底板端子对应图 (P59#2.5)
CDH4_KR5: 底板20160428 (P35.27 P59#1.4 PR8.4), 底板端子对应图 (P59#2.4)
CDH4_KR6: 底板20160428 (P35.28 P59#1.3 PR8.3), 底板端子对应图 (P59#2.3)
CDH4_KR7: 底板20160428 (P35.25 P59#1.2 PR8.2), 底板端子对应图 (P59#2.2)
CDH4_KR8: 底板20160428 (P35.26 P59#1.1 PR8.1), 底板端子对应图 (P59#2.1)
PWM11: 底板20160428 (P49.4 R121.2 U48.7), 底板端子对应图 (P?#3.7)
PWM22: 底板20160428 (P51.4 R132.1 U52.6), 底板端子对应图 (P?#4.7)
PWM33: 底板20160428 (P52.4 R117.1 U48.6), 底板端子对应图 (P?#2.7)
PWM44: 底板20160428 (P54.4 R134.2 U52.7), 底板端子对应图 (P?#5.7)